# EAGLE design RJ-45 Sensor Breakout (EAGLE 9.5.2)
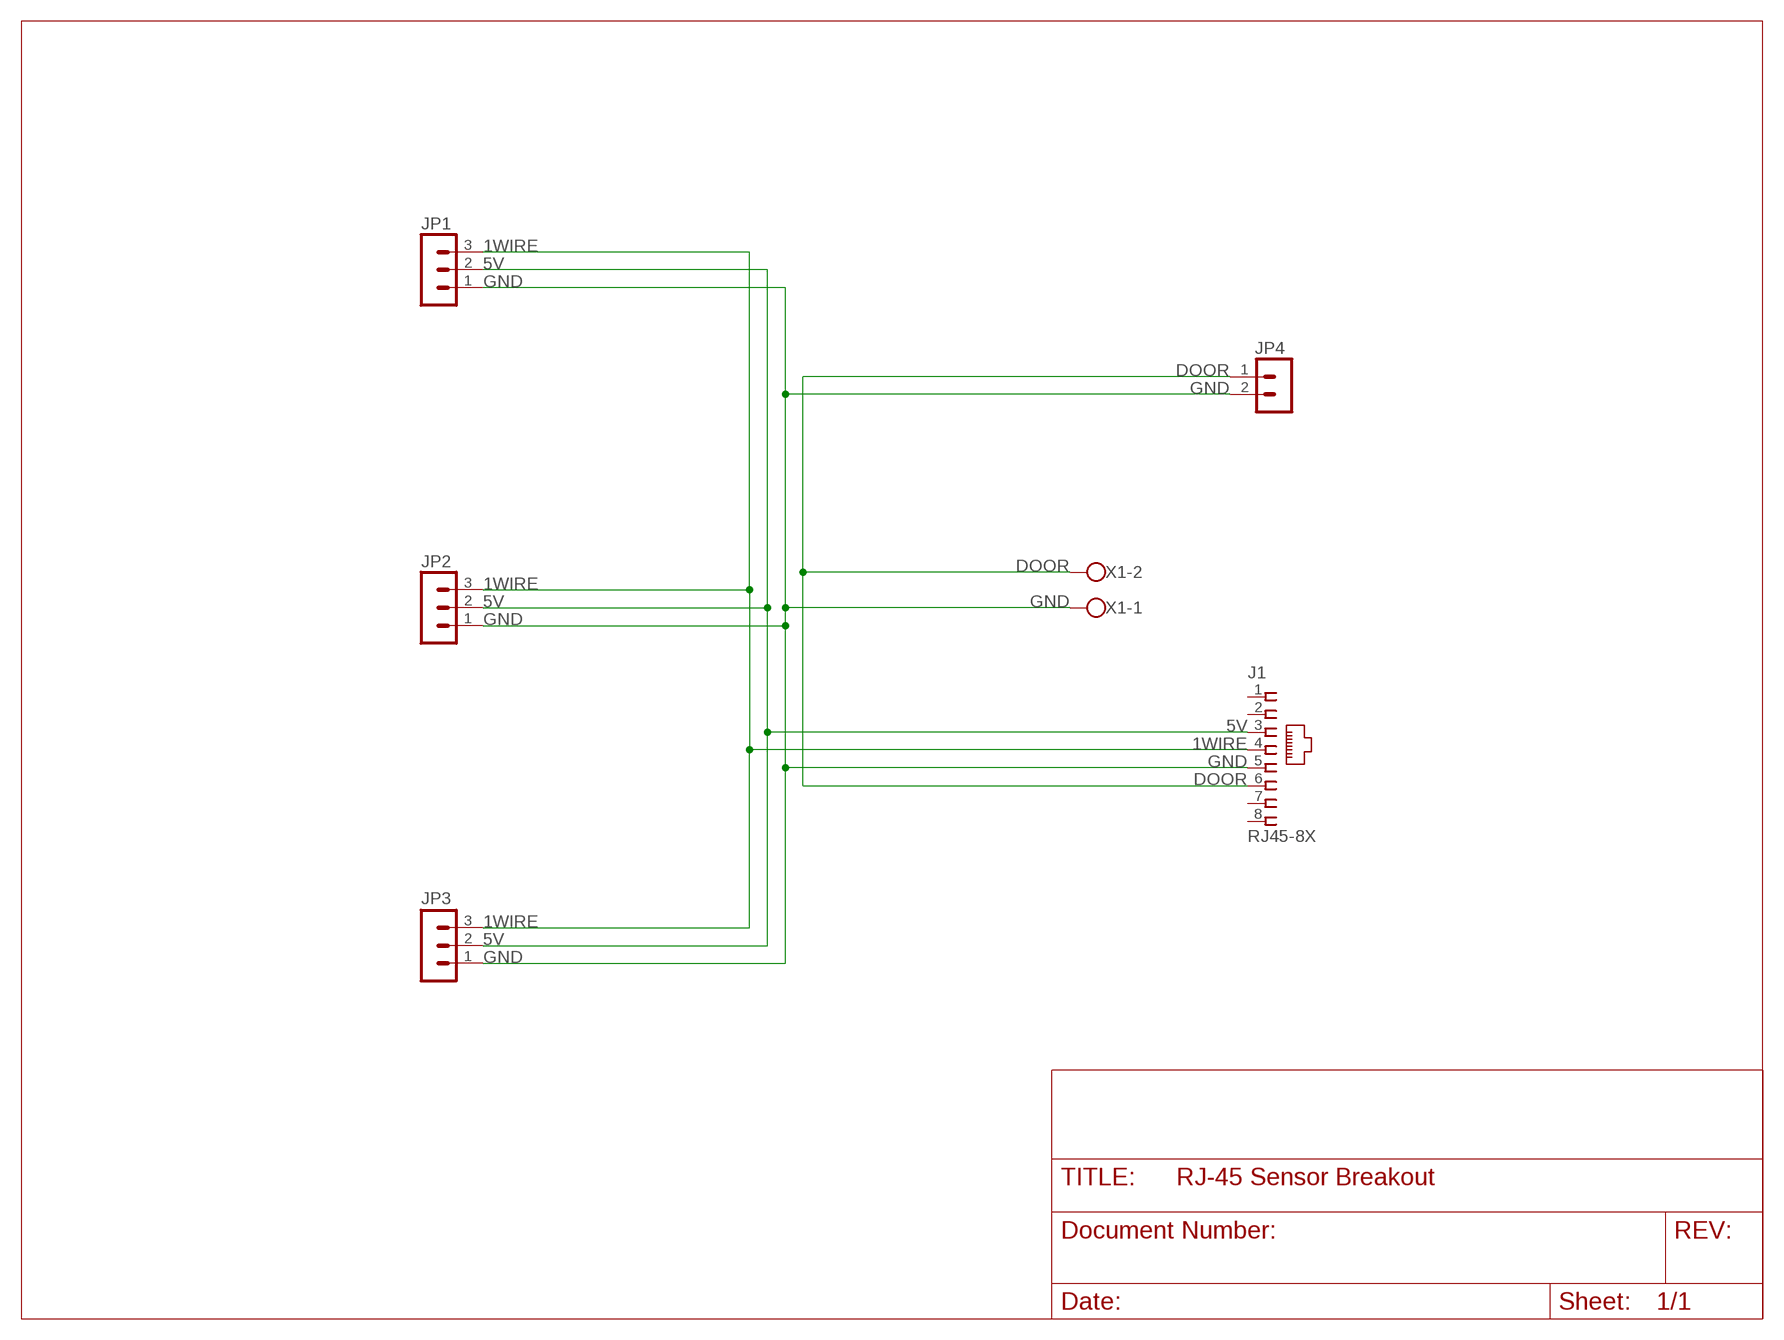
[diagram p0: schematic, sheet 1]

## Parts
J1  RJ45-8X  [RJ45-NO-SHIELD-NOLINE]
JP1  HDR-3  [HDR-3_VERT]
JP2  HDR-3  [HDR-3_VERT]
JP3  OneWire  HDR-3  [HDR-3_VERT]
JP4  HDR-2  [HDR-2_VERT]
X1  W237-102  [W237-102]

## Nets
1WIRE: J1.4 JP1.3 JP2.3 JP3.3
5V: J1.3 JP1.2 JP2.2 JP3.2
DOOR: J1.6 JP4.1 X1.2
GND: J1.5 JP1.1 JP2.1 JP3.1 JP4.2 X1.1
Unconnected: J1.1 J1.2 J1.7 J1.8

## Library data of the parts
J1 = con-tycoelectronics:RJ45: CORCOM Modular RJ Jacks No Shield Source: www.tycoelectronics.com .. ENG_DS_1654001_1099_RJ_L_0507.pdf; MPN: RJ45-8X; OC_FARNELL: unknown; OC_NEWARK: 16R6101
JP1-JP3 = Donnie:HDR-3: PIN HEADER
JP4 = Donnie:HDR-2
X1 = con-wago-500:W237-102: WAGO SCREW CLAMP; MPN: 237-102; OC_FARNELL: unknown; OC_NEWARK: 70K9898

## Board
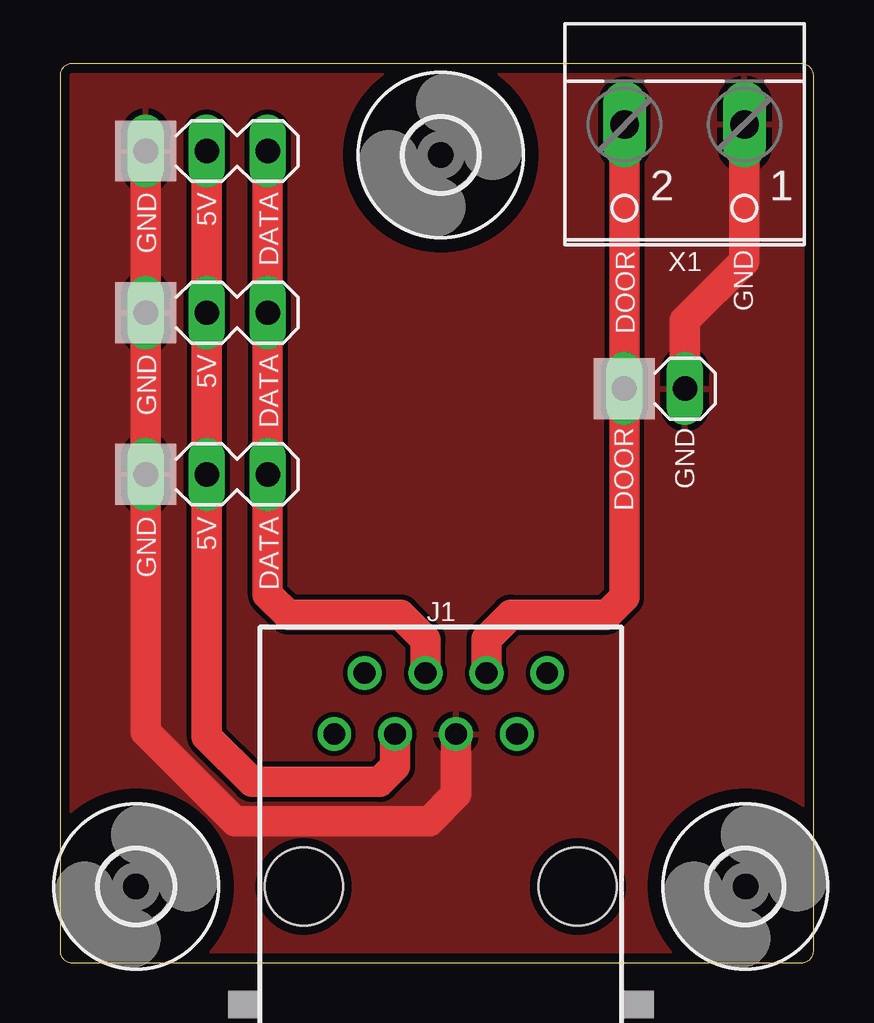
[diagram p1: board, top side]
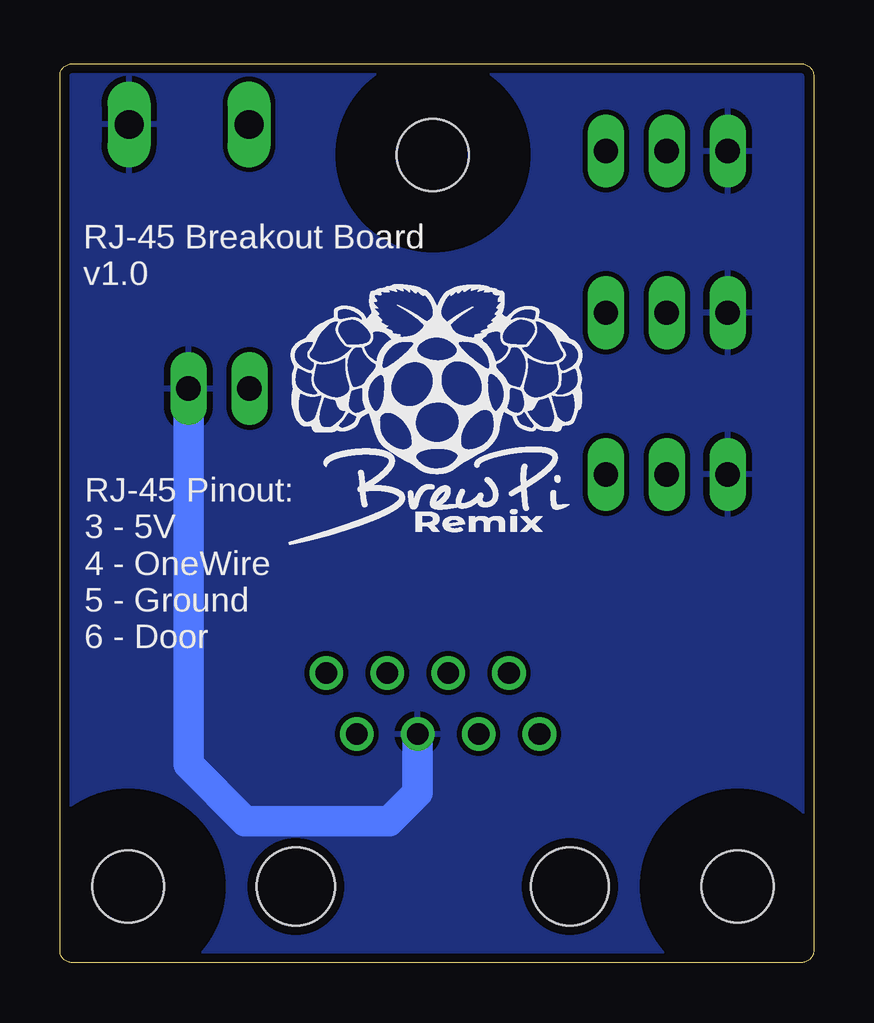
[diagram p2: board, bottom side, seen from below]

Size 31.42 x 37.45 mm. Coordinates in mm from the lower left corner, seen from the top.
Outline: 0,36.95 0,0.5 arc90 0.5,0 30.92,0 arc90 31.42,0.5 31.42,36.95 arc90 30.92,37.45 0.5,37.45 arc90 0,36.95
Copper layers 1*16: Top 0.0356mm / dielectric 1.5011mm / Bottom 0.0356mm
Design rules "PCBs_io *": minimum track width 6mil, minimum drill 13mil, track to track 8mil, track to pad 8mil, pad to pad 8mil, via to via 8mil, smd to smd 8mil, copper to edge 15mil, drill to drill 8mil, minimum pad ring 7mil, minimum via ring 7mil, stop-mask expansion 3mil, vias tented up to drill 0mil, thermal gap 10mil

### Footprints (pad centres in the part's own frame; a part is rotated, then mirrored left to right if it is on the bottom)
RJ45-NO-SHIELD-NOLINE = drill 0.9 pad 1.4: 1 -4.445,6.35; 2 -3.175,8.89; 3 -1.905,6.35; 4 -0.635,8.89; 5 0.635,6.35; 6 1.905,8.89; 7 3.175,6.35; 8 4.445,8.89 | hole 3.251: -5.715,0; 5.715,0
HDR-3_VERT = drill 1.016 long: 1 0,0; 2 2.54,0; 3 5.08,0
HDR-2_VERT = drill 1.016 long: 1 0,0; 2 2.54,0
3,0 = hole 3: 0,0
W237-102 = drill 1.194 long: 1 -2.5,-1.27; 2 2.5,-1.27

### Placement (x,y rotation side)
J1  15.88,3.17 0 top
JP1  3.58,20.34 0 top
JP2  3.58,27.08 0 top
JP3  3.58,33.82 0 top
JP4  23.52,23.92 0 top
U$1  [3,0]  28.57,3.17 0 top
U$2  [3,0]  3.17,3.17 0 top
U$3  [3,0]  15.88,33.66 0 top
X1  26.04,33.66 180 top

### Tracks (layer width: path | path; a pad name or v marks a point on that pad's centre or on a via)
1WIRE
  Top 1.27: JP3.3 JP2.3 8.66,20.5 JP1.3 8.66,15.34 9.5,14.5 14.2,14.5 15.24,13.46 J1.4
5V
  Top 1.27: J1.3 13.97,8.18 13.32,7.53 8.01,7.53 6.12,9.42 JP1.2 JP2.2 JP3.2
DOOR
  Top 1.27: J1.6 17.78,13.48 18.8,14.5 22.8,14.5 23.52,15.22 JP4.1 23.54,23.93 X1.2
GND
  Top 1.27: JP3.1 JP2.1 JP1.1 3.58,9.62 7.3,5.9 15.4,5.9 16.51,7.01 J1.5 | X1.1 28.54,29.23 26.06,26.76 JP4.2
  Bottom 1.27: JP4.2 26.06,8.26 23.7,5.9 17.7,5.9 16.51,7.09 J1.5
  pour Top: -0.6,38 -0.6,-0.8 32.2,-0.8 32.2,37.9
  pour Bottom: 32.2,38 32.2,-0.8 -0.7,-0.8 -0.8,-0.7 -0.8,37.9 -0.7,38 32,38 32.1,37.9

### Text on the board
tNames: GND | 5V | DATA | DOOR | GND | GND | 5V | DATA | DOOR | GND | GND | 5V | DATA
bNames: RJ-45 Breakout Board / v1.0 | RJ-45 Pinout: / 3 - 5V / 4 - OneWire / 5 - Ground / 6 - Door